# Altium project 555.PrjPcb
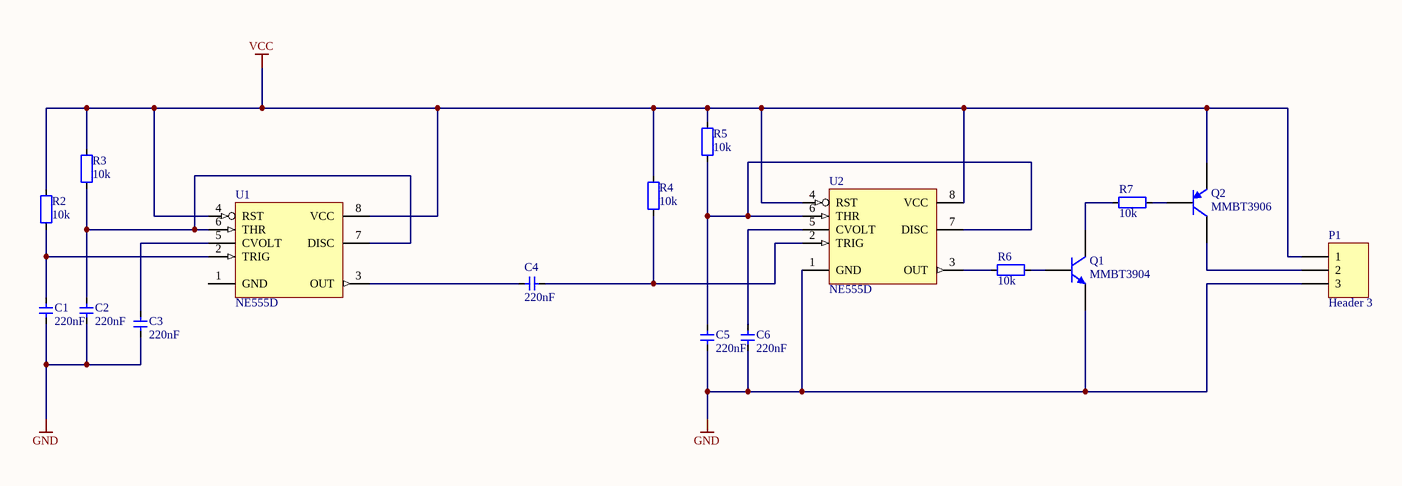
[diagram p0: dual monostable.SchDoc]
1 sheet, 17 parts. Net scope: global (net labels, ports and power ports of the same name join across sheets).
Board file: dual monostable.PcbDoc

## Sheet dual monostable.SchDoc
size A4

### Parts
C1  value 220nF  [CAP_0603]  (hidden comment: Cap_0603)
C2  value 220nF  [CAP_0603]  (hidden comment: Cap_0603)
C3  value 220nF  [CAP_0603]  (hidden comment: Cap_0603)
C4  value 220nF  [CAP_0603]  (hidden comment: Cap_0603)
C5  value 220nF  [CAP_0603]  (hidden comment: Cap_0603)
C6  value 220nF  [CAP_0603]  (hidden comment: Cap_0603)
P1  Header 3  [HDR1X3]
Q1  MMBT3904  [SOT23_N]
Q2  MMBT3906  [SOT23_N]
R2  value 10k  [RES_0603]  (hidden comment: Res_0603)
R3  value 10k  [RES_0603]  (hidden comment: Res_0603)
R4  value 10k  [RES_0603]  (hidden comment: Res_0603)
R5  value 10k  [RES_0603]  (hidden comment: Res_0603)
R6  value 10k  [RES_0603]  (hidden comment: Res_0603)
R7  value 10k  [RES_0603]  (hidden comment: Res_0603)
U1  NE555D  [D008_N]
U2  NE555D  [D008_N]

### Nets
GND: C1.2 C2.1 C3.1 C5.1 C6.1 P1.3 Q1.2(E) U2.1(GND)
VCC: P1.1 Q2.2(E) R2.2 R3.2 R4.2 R5.2 U1.4(RST) U1.8(VCC) U2.4(RST) U2.8(VCC)
NetC1_1: C1.1 R2.1 U1.2(TRIG)
NetC2_2: C2.2 R3.1 U1.6(THR) U1.7(DISC)
NetC3_2: C3.2 U1.5(CVOLT)
NetC4_1: C4.1 R4.1 U2.2(TRIG)
NetC4_2: C4.2 U1.3(OUT)
NetC5_2: C5.2 R5.1 U2.6(THR) U2.7(DISC)
NetC6_2: C6.2 U2.5(CVOLT)
NetP1_2: P1.2 Q2.3(C)
NetQ1_1: Q1.1(B) R6.1
NetQ1_3: Q1.3(C) R7.2
NetQ2_1: Q2.1(B) R7.1
NetR6_2: R6.2 U2.3(OUT)

Not connected (* = marked no-connect by the designer): U1 1(GND)

### Library data of the parts
C1-C6 = Cap_0603: Capacitor
P1 = Header 3: Header, 3-Pin; LatestRevisionDate: 17-Jul-2002; LatestRevisionNote: Re-released for DXP Platform.; Publisher: Altium Limited
Q1 = MMBT3904: NPN Switching Transistor; Published: 17-Sep-2003; LatestRevisionDate: 12-Dec-2006; LatestRevisionNote: IPC-7351 Footprint Added.; DatasheetVersion: 13-May-2002; PackageVersion: May-1999; PackageReference: SOT23; Publisher: Altium Limited; PackageDescription: 3-Pin SOT-23 Package 0.95 mm Pitch, 2.3 mm Lead Span; ComponentLink1Description: Manufacturer Link; ComponentLink1URL: http://www.semiconductors.philips.com/; ComponentLink2Description: Datasheet; ComponentLink2URL: http://www.semiconductors.philips.com/acrobat/datasheets/MMBT3904_4.pdf; Supplier Part Number 1: MMBT3904FSCT-ND; Supplier 1: Digi-Key
Q2 = MMBT3906: PNP Switching Transistor; Published: 17-Sep-2003; LatestRevisionDate: 12-Dec-2006; LatestRevisionNote: IPC-7351 Footprint Added.; DatasheetVersion: 11-Apr-2000; PackageVersion: May-1999; PackageReference: SOT23; Publisher: Altium Limited; PackageDescription: 3-Pin SOT-23 Package 0.95 mm Pitch, 2.3 mm Lead Span; ComponentLink1Description: Manufacturer Link; ComponentLink1URL: http://www.semiconductors.philips.com/; ComponentLink2Description: Datasheet; ComponentLink2URL: http://www.semiconductors.philips.com/acrobat/datasheets/MMBT3906_2.pdf
R2-R7 = Res_0603: Resistor
U1 U2 = NE555D: Precision Timer; Published: 16-Jan-2001; LatestRevisionDate: 13-Apr-2006; LatestRevisionNote: IPC-7351 Footprint Added.; DatasheetVersion: Feb-1992; PackageVersion: Jan-1998; PackageReference: D008; Publisher: Altium Limited; PackageDescription: 8-Pin Small Outline Integrated Circuit 1.27 mm Pitch; Code_IPC: SOIC127P600-8; ComponentLink1Description: Manufacturer Link; ComponentLink1URL: http://www.ti.com/; ComponentLink2Description: Datasheet; ComponentLink2URL: http://www-s.ti.com/sc/ds/ne555.pdf